# EAGLE design akkuvizsgáló (EAGLE 6.5.0)
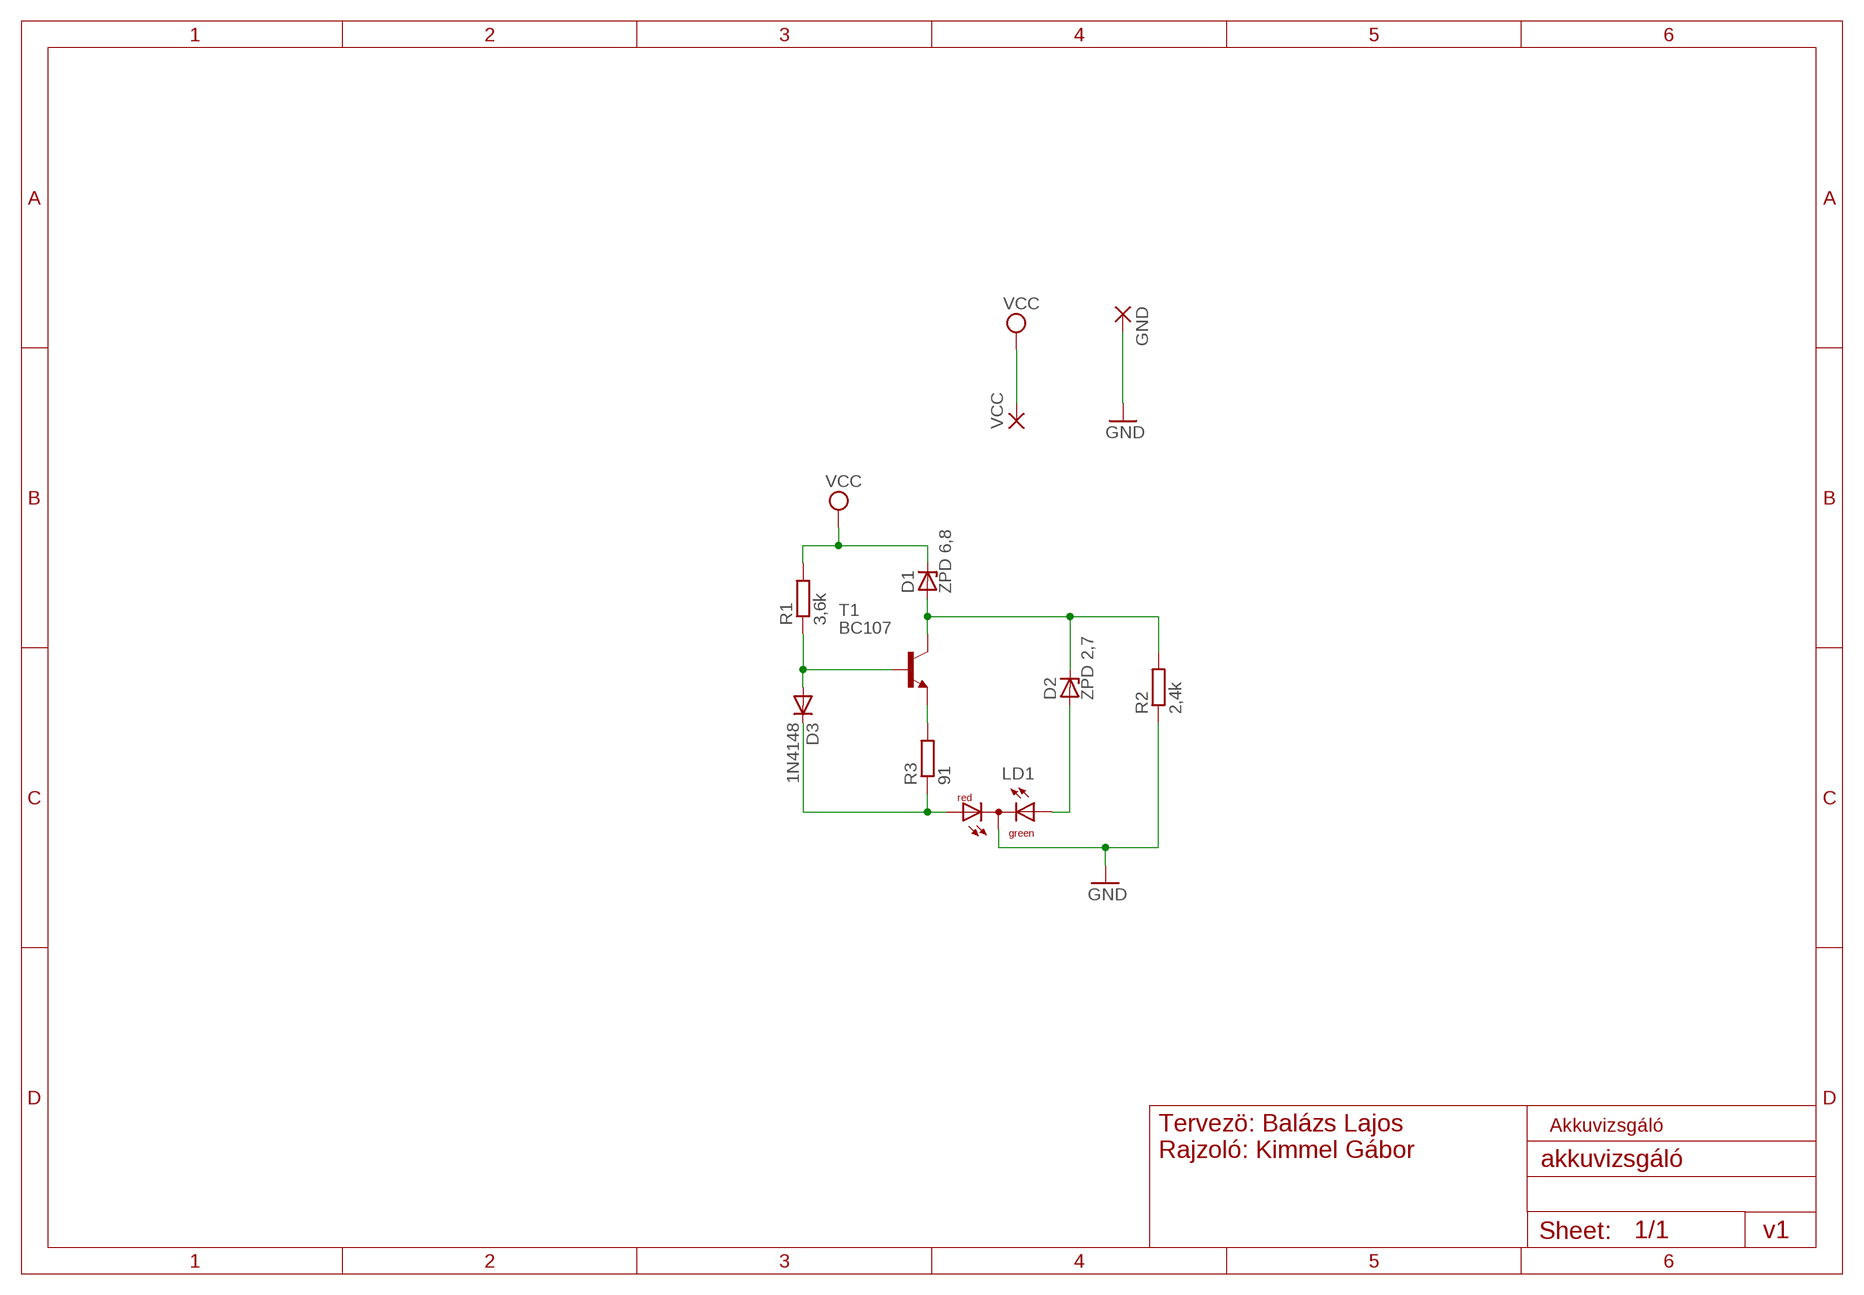
[diagram p0: schematic, sheet 1]

## Parts
D1  ZPD 6,8  ZPD  [DO35Z10]
D2  ZPD 2,7  ZPD  [DO35Z10]
D3  1N4148  1N4148DO35-10  [DO35-10]
GND  2,15/1,0  [2,15/1,0]
LD1  DUOLED-RG-C  [DUOLED-C-5MM]
R1  3,6k  R-EU_0204/7  [0204/7]
R2  2,4k  R-EU_0204/7  [0204/7]
R3  91  R-EU_0204/7  [0204/7]
T1  BC107  [TO18]
VCC  2,15/1,0  [2,15/1,0]

## Nets
GND: GND.1(P) LD1.C R2.1
N$1: R3.2 T1.1(E)
N$2: D3.A R1.1 T1.2(B)
N$3: D3.C LD1.AR R3.1
N$4: D1.A D2.C R2.2 T1.3(C)
N$5: D2.A LD1.AX(AG)
VCC: D1.C R1.2 VCC.1(P)

## Notes on the sheet
- Tervezö: Balázs Lajos
  Rajzoló: Kimmel Gábor
- Akkuvizsgáló
- v1

## Library data of the parts
D1 D2 = diode:ZPD: Z DIODE 500 mW
D3 = diode:1N4148: DIODE high speed (Philips)
GND VCC = wirepad:2,15/1,0: THROUGH-HOLE PAD
LD1 = led:DUOLED-RG-C: DUO LED 2 colors (red/green), 5 mm, round, common Cathode www.ligitek.com or other producers.
R1-R3 = resistor:R-EU_: RESISTOR, European symbol
T1 = transistor:BC107: NPN TRANSISTOR

## Board
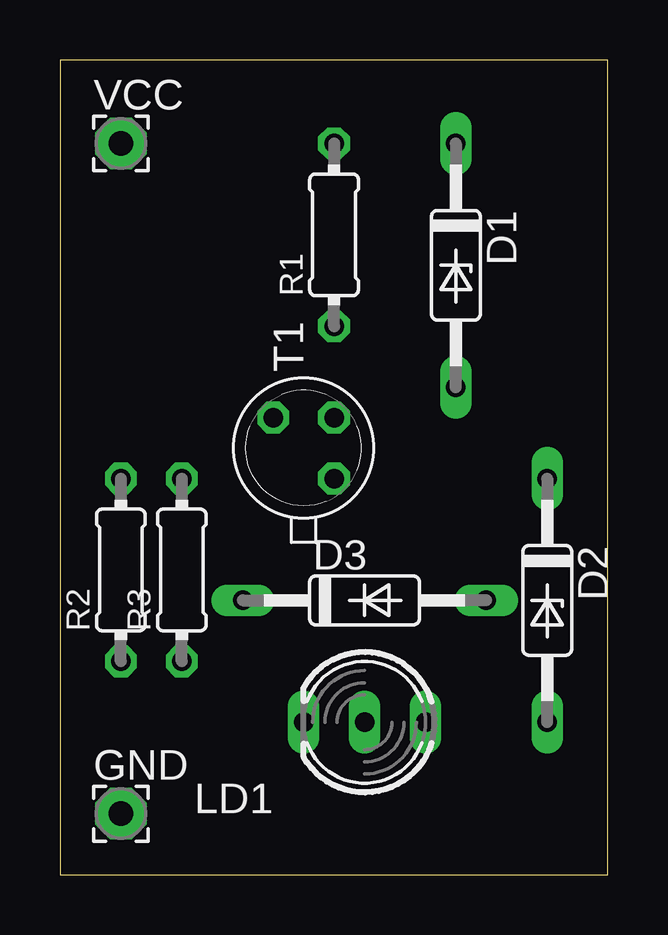
[diagram p1: board, top side]
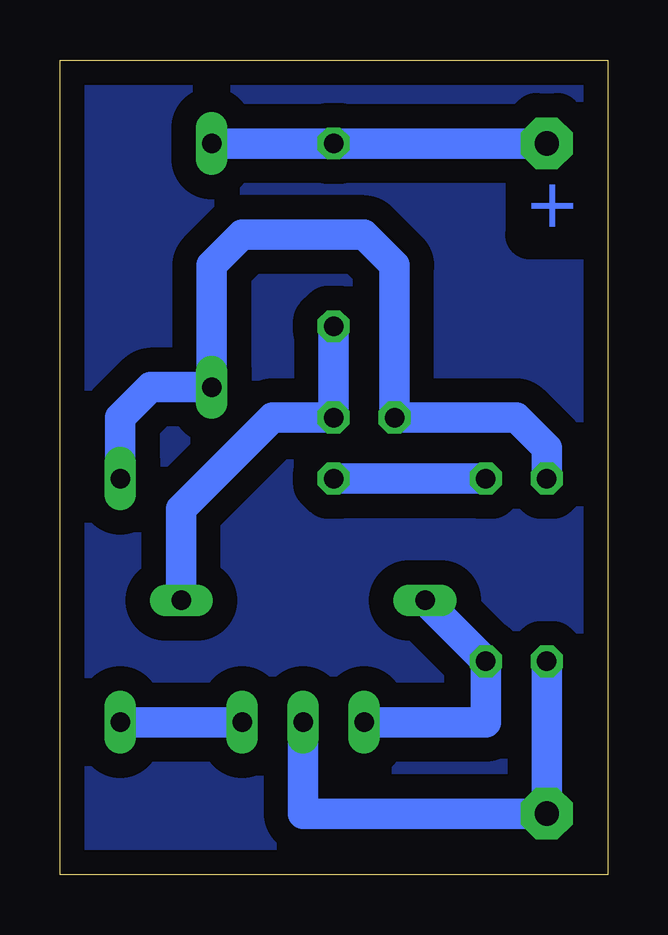
[diagram p2: board, bottom side, seen from below]

Size 22.84 x 33.96 mm. Coordinates in mm from the lower left corner, seen from the top.
Outline: 0,0 22.84,0 22.84,33.96 0,33.96 0,0
Copper layers (1*16): Top 0.035mm / dielectric 1.5mm / Bottom 0.035mm
Design rules "default *": minimum track width 10mil, minimum drill 24mil, track to track 8mil, track to pad 8mil, pad to pad 8mil, via to via 8mil, smd to smd 8mil, copper to edge 40mil, drill to drill 8mil, minimum pad ring 10mil, minimum via ring 8mil, stop-mask expansion 4mil, vias tented up to drill 0mil, thermal gap 10mil

### Footprints (pad centres in the part's own frame; a part is rotated, then mirrored left to right if it is on the bottom)
DO35Z10 = drill 0.813 long: A 5.08,0; C -5.08,0
DO35-10 = drill 0.813 long: A 5.08,0; C -5.08,0
2,15/1,0 = drill 1.016 pad 2.159 octagon: 1 0,0
DUOLED-C-5MM = drill 0.813 long: AR 2.54,0; AX -2.54,0; C 0,0
0204/7 = drill 0.813 octagon: 1 -3.81,0; 2 3.81,0
TO18 = drill 0.813 octagon: 1 -1.27,-1.27; 2 1.27,-1.27; 3 1.27,1.27

### Placement (x,y rotation side)
D1  16.51,25.4 270 top
D2  20.32,11.43 270 top
D3  12.7,11.43 0 top
GND  2.54,2.54 0 top
LD1  12.7,6.35 180 top
R1  11.43,26.67 90 top
R2  2.54,12.7 90 top
R3  5.08,12.7 90 top
T1  10.16,17.78 90 top
VCC  2.54,30.48 0 top

### Tracks (layer width: path | path; a pad name or v marks a point on that pad's centre or on a via)
GND
  Bottom 1.27: LD1.C 12.7,2.54 GND.1 R2.1
N$1
  Bottom 1.27: T1.1 R3.2
N$2
  Bottom 1.27: R1.1 T1.2 13.97,19.05 17.78,15.24 D3.A
N$3
  Bottom 1.27: LD1.AR 5.08,6.35 R3.1 D3.C
N$4
  Bottom 1.27: D2.C 20.32,19.05 19.05,20.32 D1.A 16.51,25.4 15.24,26.67 10.16,26.67 8.89,25.4 T1.3 3.81,19.05 2.54,17.78 R2.2
N$5
  Bottom 1.27: LD1.AX D2.A
N$6
  pour Bottom (isolate 1.016): 0,34.29 22.86,34.29 22.86,0 0,0
VCC
  Bottom 1.27: VCC.1 R1.2 D1.C

### Text on the board
Bottom: +